# Altium project D_FEE PID.PrjPcb
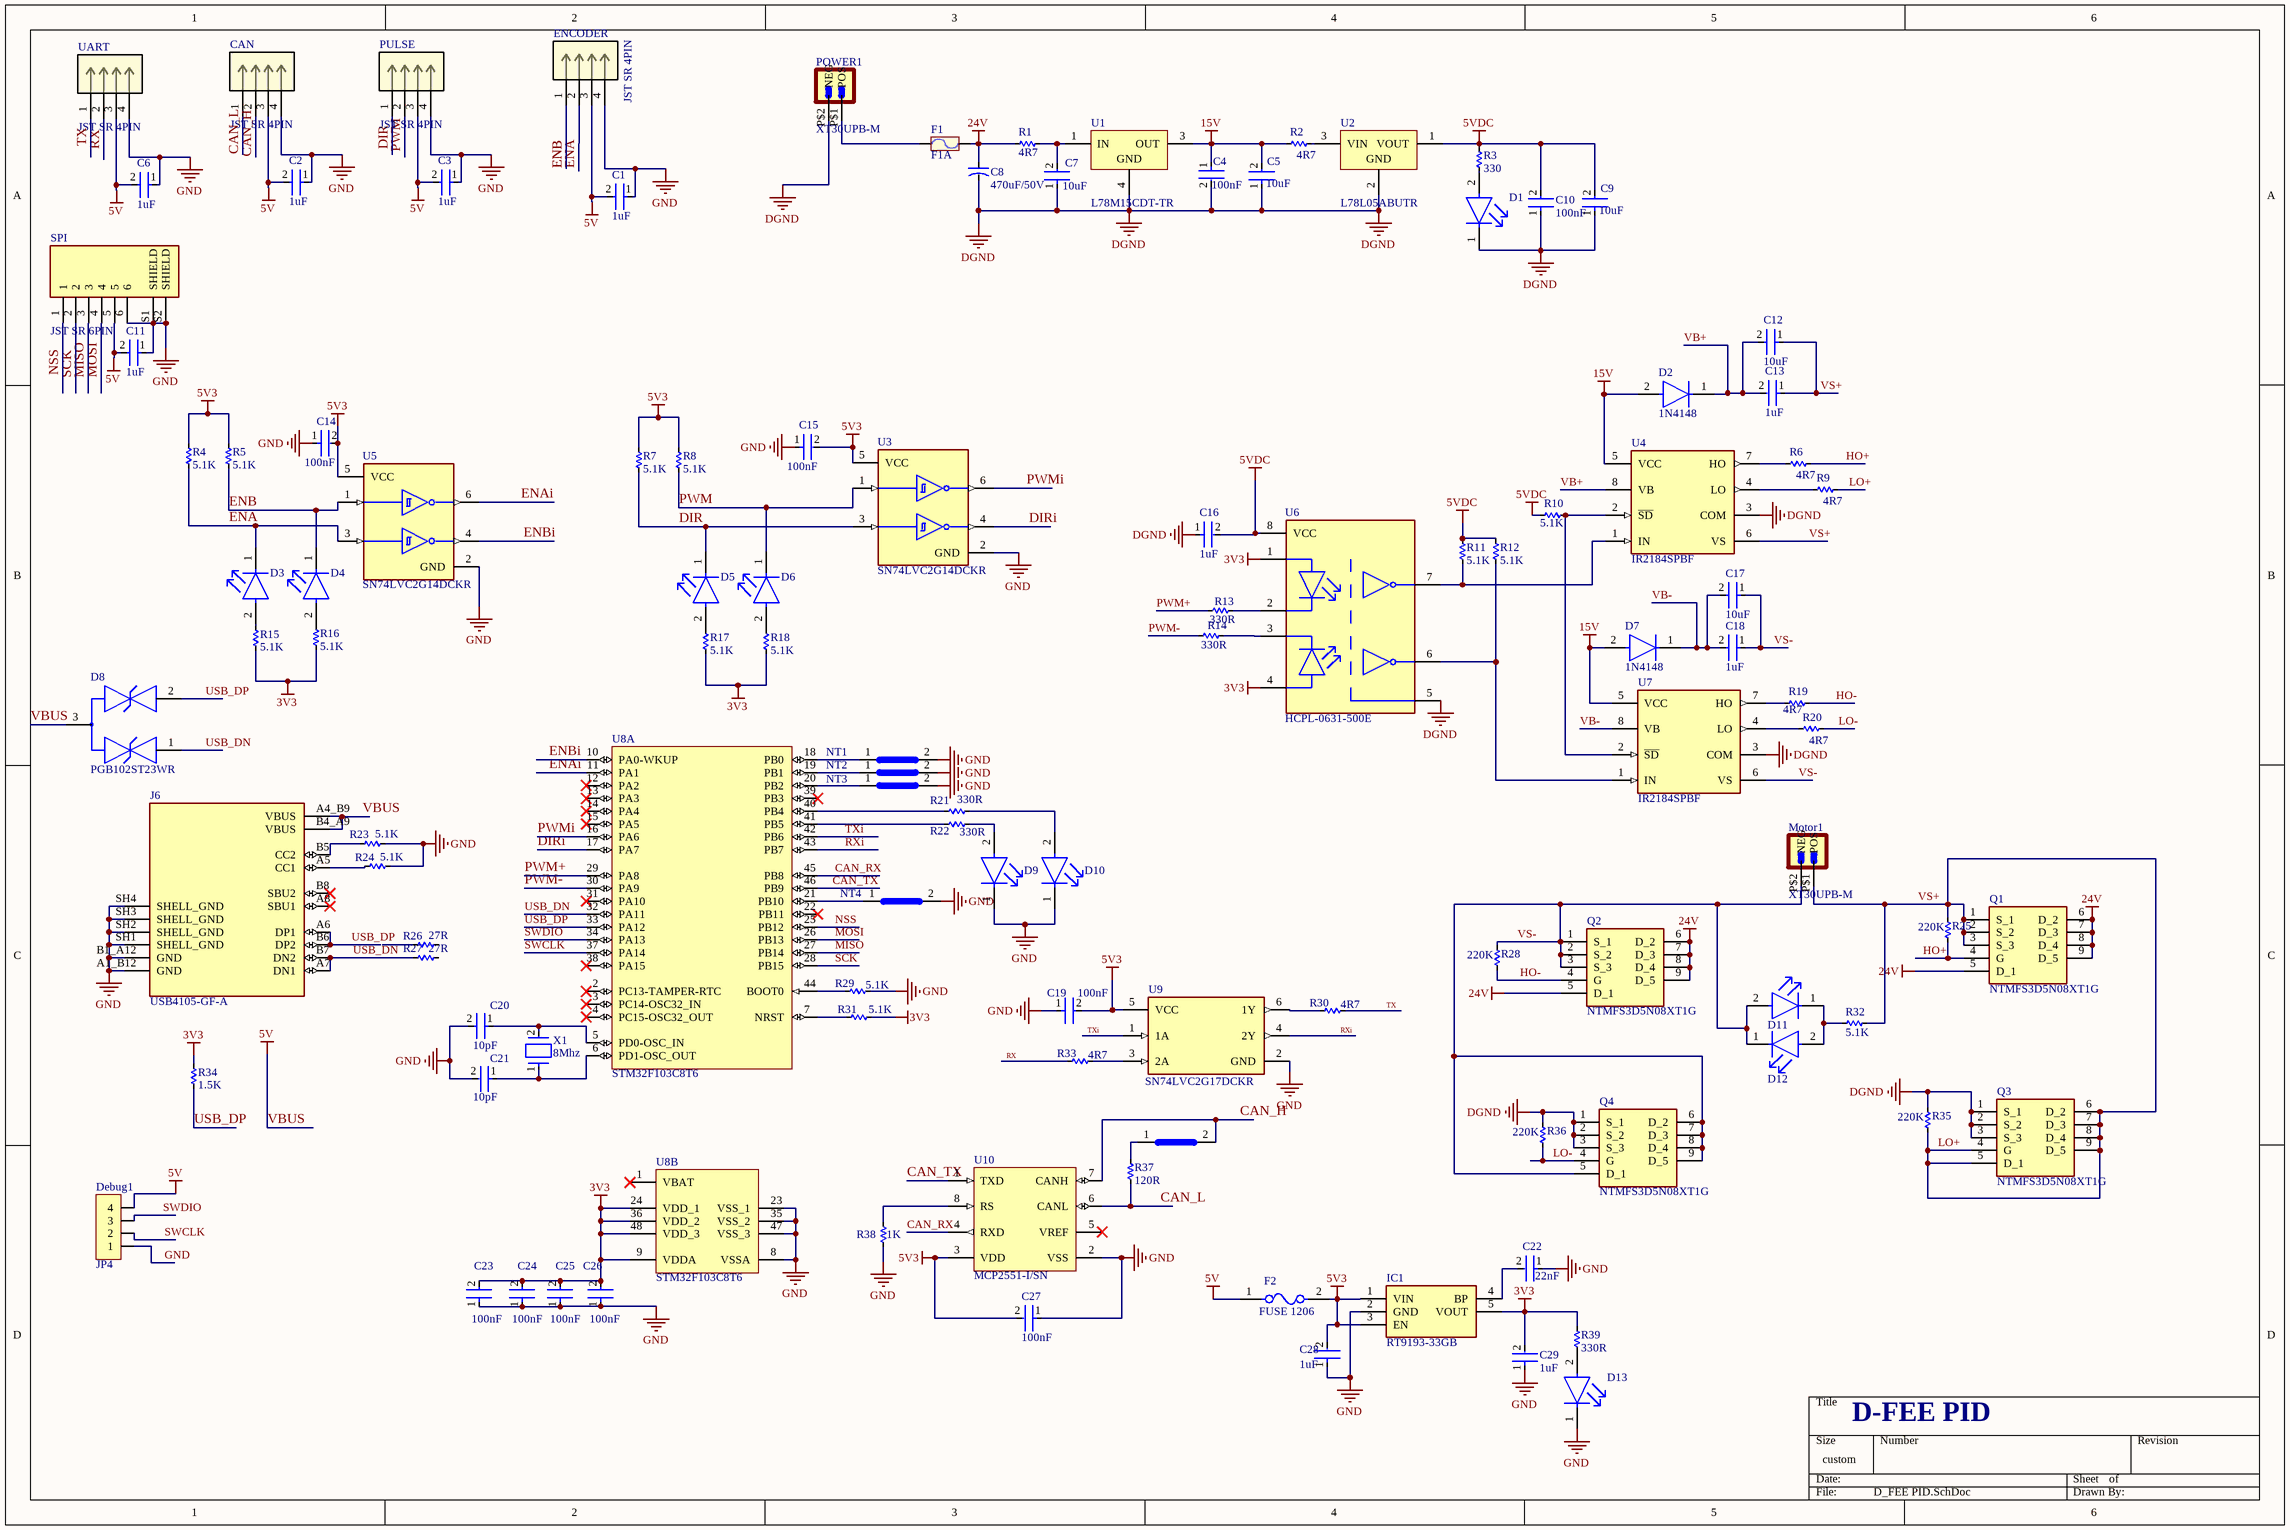
[diagram p0: D_FEE PID.SchDoc]
1 sheet, 113 parts. Net scope: global (net labels, ports and power ports of the same name join across sheets).
Board file: D_FEE PID.PcbDoc

## Sheet D_FEE PID.SchDoc
size 449 x 299 mm; SheetNumber: 1; SheetTotal: 1

### Parts
1  Node_B  [Node_B]  (value not drawn)
C1  1uF  [FP-CC0603-DA-MFG]
C2  1uF  [FP-CC0603-DA-MFG]
C3  1uF  [FP-CC0603-DA-MFG]
C4  100nF  [FP-CC0603-DA-MFG]
C5  10uF  [FP-CC0603-DA-MFG]
C6  1uF  [FP-CC0603-DA-MFG]
C7  10uF  [FP-CC0603-DA-MFG]
C8  470uF/50V  [CA-ALU-5L]
C9  10uF  [FP-CC0603-DA-MFG]
C10  100nF  [FP-CC0603-DA-MFG]
C11  1uF  [FP-CC0603-DA-MFG]
C12  10uF  [FP-CC0603-DA-MFG]
C13  1uF  [FP-CC0603-DA-MFG]
C14  100nF  [FP-CC0603-DA-MFG]
C15  100nF  [FP-CC0603-DA-MFG]
C16  1uF  [FP-CC0603-DA-MFG]
C17  10uF  [FP-CC0603-DA-MFG]
C18  1uF  [FP-CC0603-DA-MFG]
C19  100nF  [FP-CL10-0_1-MFG]
C20  10pF  [FP-CC0603-DA-MFG]
C21  10pF  [FP-CC0603-DA-MFG]
C22  22nF  [FP-CC0603-DA-MFG]
C23  100nF  [FP-CC0603-DA-MFG]
C24  100nF  [FP-CC0603-DA-MFG]
C25  100nF  [FP-CC0603-DA-MFG]
C26  100nF  [FP-CC0603-DA-MFG]
C27  100nF  [FP-CC0603-DA-MFG]
C28  1uF  [FP-CC0603-DA-MFG]
C29  1uF  [FP-CC0603-DA-MFG]
CAN  JST SR 4PIN  [JST SR 4PIN]
D1  LTST-C191KRKT  [FP-LTST-C191KRKT-MFG]  (value not drawn)
D2  1N4148  [FP-DO-213AA-MFG]
D3  LTST-C191TBKT  [FP-LTST-C191TBKT-MFG]  (value not drawn)
D4  LTST-C191TBKT  [FP-LTST-C191TBKT-MFG]  (value not drawn)
D5  LTST-C191TBKT  [FP-LTST-C191TBKT-MFG]  (value not drawn)
D6  LTST-C191TBKT  [FP-LTST-C191TBKT-MFG]  (value not drawn)
D7  1N4148  [FP-DO-213AA-MFG]
D8  PGB102ST23WR  [FP-PGB1-ST23-MFG]
D9  LTST-C191TBKT  [FP-LTST-C191TBKT-MFG]  (value not drawn)
D10  LTST-C191TBKT  [FP-LTST-C191TBKT-MFG]  (value not drawn)
D11  LTST-C191TBKT  [FP-LTST-C191TBKT-MFG]  (value not drawn)
D12  LTST-C191TBKT  [FP-LTST-C191TBKT-MFG]  (value not drawn)
D13  LTST-C191KRKT  [FP-LTST-C191KRKT-MFG]  (value not drawn)
Debug1  JP4  [JP4-C1T]
ENCODER  JST SR 4PIN  [JST SR 4PIN]
F1  F1A  [Fuse1]
F2  FUSE 1206  [FP-MF-NSMF110-2-MFG]
IC1  RT9193-33GB  [SOT94P279X130-5N]
J6  USB4105-GF-A  [GCT_USB4105-GF-A]
Motor1  XT30UPB-M  [XT30UPB-M]
NT1  Node_B  [Node_B]  (value not drawn)
NT2  Node_B  [Node_B]  (value not drawn)
NT3  Node_B  [Node_B]  (value not drawn)
NT4  Node_B  [Node_B]  (value not drawn)
POWER1  XT30UPB-M  [XT30UPB-M]
PULSE  JST SR 4PIN  [JST SR 4PIN]
Q1  NTMFS3D5N08XT1G  [NTMFS5C460NLT1G]
Q2  NTMFS3D5N08XT1G  [NTMFS5C460NLT1G]
Q3  NTMFS3D5N08XT1G  [NTMFS5C460NLT1G]
Q4  NTMFS3D5N08XT1G  [NTMFS5C460NLT1G]
R1  4R7  [RES-SMD-2010]
R2  4R7  [RES-SMD-2010]
R3  330  [RES-SMD-0603]
R4  5.1K  [RES-SMD-0603]
R5  5.1K  [RES-SMD-0603]
R6  4R7  [RES-SMD-0603]
R7  5.1K  [RES-SMD-0603]
R8  5.1K  [RES-SMD-0603]
R9  4R7  [RES-SMD-0603]
R10  5.1K  [RES-SMD-0603]
R11  5.1K  [RES-SMD-0603]
R12  5.1K  [RES-SMD-0603]
R13  330R  [RES-SMD-0603]
R14  330R  [RES-SMD-0603]
R15  5.1K  [RES-SMD-0603]
R16  5.1K  [RES-SMD-0603]
R17  5.1K  [RES-SMD-0603]
R18  5.1K  [RES-SMD-0603]
R19  4R7  [RES-SMD-0603]
R20  4R7  [RES-SMD-0603]
R21  330R  [RES-SMD-0603]
R22  330R  [RES-SMD-0603]
R23  5.1K  [RES-SMD-0603]
R24  5.1K  [RES-SMD-0603]
R25  220K  [RES-SMD-0603]
R26  27R  [RES-SMD-0603]
R27  27R  [RES-SMD-0603]
R28  220K  [RES-SMD-0603]
R29  5.1K  [RES-SMD-0603]
R30  4R7  [RES-SMD-0603]
R31  5.1K  [RES-SMD-0603]
R32  5.1K  [RES-SMD-0603]
R33  4R7  [RES-SMD-0603]
R34  1.5K  [RES-SMD-0603]
R35  220K  [RES-SMD-0603]
R36  220K  [RES-SMD-0603]
R37  120R  [RES-SMD-0603]
R38  1K  [RES-SMD-0603]
R39  330R  [RES-SMD-0603]
SPI  JST SR 6PIN  [JST SR 6PIN]
U1  L78M15CDT-TR  [TO-252_N]
U2  L78L05ABUTR  [SOT-89_L]
U3  SN74LVC2G14DCKR  [FP-DCK0006A-MFG]
U4  IR2184SPBF  [FP-PG-DSO-8-MFG]
U5  SN74LVC2G14DCKR  [FP-DCK0006A-MFG]
U6  HCPL-0631-500E  [FP-HCPL-0631-500E-IPC_C]
U7  IR2184SPBF  [FP-PG-DSO-8-MFG]
U8  STM32F103C8T6  [STM-LQFP48_L]  (parts A,B of 2)
U9  SN74LVC2G17DCKR  [FP-DCK0006A-MFG]
U10  MCP2551-I/SN  [MCHP-SN8_V]
UART  JST SR 4PIN  [JST SR 4PIN]
X1  8Mhz  [FP-ABM7-MFG]

### Nets
3V3: C23.2 C24.2 C25.2 C26.2 C29.2 IC1.5(VOUT) R15.2 R16.2 R17.2 R18.2 R31.1 R34.1 R39.1 U6.1(ANODE_1) U6.4(ANODE_2) U8.9(VDDA) U8.24(VDD_1) U8.36(VDD_2) U8.48(VDD_3)
5V3: C14.2 C15.2 C19.2 C27.2 C28.2 F2.2 IC1.1(VIN) IC1.3(EN) R4.1 R5.1 R7.1 R8.1 U3.5(VCC) U5.5(VCC) U9.5(VCC) U10.3(VDD)
5VDC: C9.2 C10.2 C16.2 R3.1 R10.1 R11.1 R12.1 U2.1(VOUT) U6.8(VCC)
15V: C4.1 C5.2 D2.2(A) D7.2(A) R2.2 U1.3(OUT) U4.5(VCC) U7.5(VCC)
24V: C8.1 F1.2 Q1.5(D_1) Q1.6(D_2) Q1.7(D_3) Q1.8(D_4) Q1.9(D_5) Q2.5(D_1) Q2.6(D_2) Q2.7(D_3) Q2.8(D_4) Q2.9(D_5) R1.2
DGND: C4.2 C5.1 C7.1 C8.2 C9.1 C10.1 C16.1 D1.1(C) POWER1.P$2(NEG) Q3.1(S_1) Q3.2(S_2) Q3.3(S_3) Q4.1(S_1) Q4.2(S_2) Q4.3(S_3) R35.1 R36.1 U1.4(GND) U2.2(GND) U4.3(COM) U6.5(GND) U7.3(COM)
GND: C1.1 C2.1 C3.1 C6.1 C11.1 C14.1 C15.1 C19.1 C20.2 C21.2 C22.1 C23.1 C24.1 C25.1 C26.1 C27.1 C28.1 C29.1 CAN.4 D9.1(C) D10.1(C) D13.1(C) Debug1.1 ENCODER.4 IC1.2(GND) J6.A1_B12(GND) J6.B1_A12(GND) J6.SH1(SHELL_GND) J6.SH2(SHELL_GND) J6.SH3(SHELL_GND) J6.SH4(SHELL_GND) NT1.2 NT2.2 NT3.2 NT4.2 PULSE.4 R23.1 R24.1 R29.1 R38.2 SPI.6 SPI.S1(SHIELD) SPI.S2(SHIELD) U3.2(GND) U5.2(GND) U8.8(VSSA) U8.23(VSS_1) U8.35(VSS_2) U8.47(VSS_3) U9.2(GND) U10.2(VSS) UART.4
VBUS: C1.2 C2.2 C3.2 C6.2 C11.2 CAN.3 D8.3 Debug1.4 ENCODER.3 F2.1 J6.A4_B9(VBUS) J6.B4_A9(VBUS) PULSE.3 SPI.5 UART.3  [also labelled 5V]
CAN_H: 1.2 CAN.2 U10.7(CANH)
CAN_L: CAN.1 R37.2 U10.6(CANL)
CAN_RX: U8.45(PB8) U10.4(RXD)
CAN_TX: U8.46(PB9) U10.1(TXD)
DIR: D5.1(C) PULSE.1 R7.2 U3.3(2A)
DIRi: U3.4(2Y) U8.17(PA7)
ENA: D3.1(C) ENCODER.2 R4.2 U5.3(2A)
ENAi: U5.6(1Y) U8.11(PA1)
ENB: D4.1(C) ENCODER.1 R5.2 U5.1(1A)
ENBi: U5.4(2Y) U8.10(PA0-WKUP)
HO+: Q1.4(G) R6.1 R25.2
HO-: Q2.4(G) R19.1 R28.2
LO+: C12.1 C13.1 Motor1.P$1(POS) Q1.1(S_1) Q1.2(S_2) Q1.3(S_3) Q3.4(G) Q3.5(D_1) Q3.6(D_2) Q3.7(D_3) Q3.8(D_4) Q3.9(D_5) R9.1 R25.1 R32.2 R35.2 U4.6(VS)  [also labelled VS+]
LO-: Q4.4(G) R20.1 R36.2
MISO: SPI.3 U8.27(PB14)
MOSI: SPI.4 U8.26(PB13)
NSS: SPI.1 U8.25(PB12)
PWM: D6.1(C) PULSE.2 R8.2 U3.1(1A)
PWM+: R13.2 U8.29(PA8)
PWM-: R14.2 U8.30(PA9)
PWMi: U3.6(1Y) U8.16(PA6)
RX: R33.2 UART.2
RXi: U8.43(PB7) U9.4(2Y)
SCK: SPI.2 U8.28(PB15)
SWCLK: Debug1.2 U8.37(PA14)
SWDIO: Debug1.3 U8.34(PA13)
TX: R30.1 UART.1
TXi: U8.42(PB6) U9.1(1A)
USB_DN: D8.1 J6.A7(DN1) J6.B7(DN2) R27.2 U8.32(PA11)
USB_DP: D8.2 J6.A6(DP1) J6.B6(DP2) R34.2 U8.33(PA12)
VB+: C12.2 C13.2 D2.1(C) U4.8(VB)
VB-: C17.2 C18.2 D7.1(C) U7.8(VB)
VS-: C17.1 C18.1 D11.2(A) D12.1(C) Motor1.P$2(NEG) Q2.1(S_1) Q2.2(S_2) Q2.3(S_3) Q4.5(D_1) Q4.6(D_2) Q4.7(D_3) Q4.8(D_4) Q4.9(D_5) R28.1 U7.6(VS)
Net1_1: 1.1(Node?) R37.1
NetC7_2: C7.2 R1.1 U1.1(IN)
NetC20_1: C20.1 U8.5(PD0-OSC_IN) X1.2
NetC21_1: C21.1 U8.6(PD1-OSC_OUT) X1.1
NetC22_2: C22.2 IC1.4(BP)
NetD1_2: D1.2(A) R3.2
NetD3_2: D3.2(A) R15.1
NetD4_2: D4.2(A) R16.1
NetD5_2: D5.2(A) R17.1
NetD6_2: D6.2(A) R18.1
NetD9_2: D9.2(A) R22.2
NetD10_2: D10.2(A) R21.2
NetD11_1: D11.1(C) D12.2(A) R32.1
NetD13_2: D13.2(A) R39.2
NetF1_1: F1.1 POWER1.P$1(POS)
NetJ6_A5: J6.A5(CC1) R24.2
NetJ6_B5: J6.B5(CC2) R23.2
NetNT1_1: NT1.1(Node?) U8.18(PB0)
NetNT2_1: NT2.1(Node?) U8.19(PB1)
NetNT3_1: NT3.1(Node?) U8.20(PB2)
NetNT4_1: NT4.1(Node?) U8.21(PB10)
NetR2_1: R2.1 U2.3(VIN)
NetR6_2: R6.2 U4.7(HO)
NetR9_2: R9.2 U4.4(LO)
NetR10_2: R10.2 U4.2(~{SD}) U7.2(~{SD})
NetR11_2: R11.2 U4.1(IN) U6.7(VO1)
NetR12_2: R12.2 U6.6(VO2) U7.1(IN)
NetR13_1: R13.1 U6.2(CATHODE_1)
NetR14_1: R14.1 U6.3(CATHODE_2)
NetR19_2: R19.2 U7.7(HO)
NetR20_2: R20.2 U7.4(LO)
NetR21_1: R21.1 U8.40(PB4)
NetR22_1: R22.1 U8.41(PB5)
NetR29_2: R29.2 U8.44(BOOT0)
NetR30_2: R30.2 U9.6(1Y)
NetR31_2: R31.2 U8.7(NRST)
NetR33_1: R33.1 U9.3(2A)
NetR38_1: R38.1 U10.8(RS)

Not connected (* = marked no-connect by the designer): J6 A8(SBU1)* B8(SBU2)*; R26 1 2; R27 1; U8 1(VBAT)* 2(PC13-TAMPER-RTC)* 3(PC14-OSC32_IN)* 4(PC15-OSC32_OUT)* 12(PA2)* 13(PA3)* 14(PA4)* 15(PA5)* 22(PB11)* 31(PA10)* 38(PA15)* 39(PB3)*; U10 5(VREF)*

### Notes on the sheet
- D-FEE PID

### Library data of the parts
1 NT1-NT4 = Node_B: Node
C1-C7 C9-C18 C20-C29 = CMP-2100-03600-2: CAP CER 10000PF 50V X7R 0603; Manufacturer Part Number: CC0603KRX7R9BB103; Manufacturer: YAGEO; Tolerance: 0.1; Material: Ceramic; Temperature Coefficient: 15%; Value: 10 nF; Mouser Description: Multilayer Ceramic Capacitor, CC Series, 0.01 - F, - 10%, X7R, 50 V, 0603 [1608 Metric]; Digikey Description: CAP CER 10000PF 50V X7R 0603; Height: 0.9mm; Category: Cap; Temperature Characteristic: X7R; Footprint Url: http://www.yageo.com/exep/pages/download/literatures/UPY-C_GEN_24.pdf; Lead Free: Yes; Voltage Rating: 50 V; Temperature: -55°C to +125°C; Device Class L3: Ceramic Capacitors; ComponentLink2Description: Datasheet; Voltage: 50 V; Package: CC0603-DA; Octopart: https://octopart.com/cc0603krx7r9bb103-yageo-192938; Automotive: No; Temperature Range High: +125°C; Temperature Range Low: -55°C; RoHS: TRUE; Device Class L1: Passive Components; ComponentLink2URL: http://www.yageo.com/documents/recent/UPY-GPHC_X7R_6.3V-to-50V_18.pdf; Device Class L2: Capacitors; Capacitance: 10 nF
C8 = CN-ALU-DIP: Capacitor (Semiconductor SIM Model); Value: 104; LatestRevisionDate: 17-Jul-2002; LatestRevisionNote: Re-released for DXP Platform.; PackageReference: C1206; Publisher: Altium Limited
C19 = CMP-13271-000011-1: CAP CER 0.1UF 50V X7R 0603; Manufacturer: Samsung Electro-Mechanics America, Inc; Manufacturer Part Number: CL10B104JB8NNNC; Material: Ceramic; Temperature Coefficient: 15%; Tolerance: 5%; Ipc Land Pattern Name: CAPC16080X80; Device Class L1: Passive Components; Digikey Description: CAP CER 0.1UF 50V X7R 0603; Voltage Rating: 50V; Height: 0.9mm; ComponentLink2Description: Datasheet; Device Class L2: Capacitors; ComponentLink2URL: http://www.samsungsem.com/kr/support/product-search/mlcc/__icsFiles/afieldfile/2019/06/18/CL10B104JB8NNNC-19.pdf; Temperature Characteristic: X7R; Value: 100nF; Temperature Range High: +125°C; Lead Free: Yes; Temperature Range Low: -55°C; Category: Cap; Package: CL10-0.1; Temperature: -55°C to +125°C; Octopart: https://octopart.com/cl10b104jb8nnnc-samsung-9302151; Device Class L3: Ceramic Capacitors; RoHS: TRUE; Automotive: No; Capacitance: 100nF
CAN ENCODER PULSE UART = JST SR 4PIN: SM04B-SRSS-TB; Mfr_Name: JST; RefDes: RefDes; Type: Type
D1 D13 = CMP-2000-05199-2: NexarPartId: 549908; Illumination Color: Red; Lens Transparency: Clear; Luminous Intensity: 54mcd; Current: 2A; Forward Current: 20mA; Number of Elements: 1; Power Rating: 75mW; Lens Color: Colorless; Wavelength: 639nm; Viewing Angle: 130°; Voltage: 2V; Dominant Wavelength: 631nm; Reverse Voltage: 5V; Height: 550µm; Length: 1.6mm; Number of Pins: 2; Packaging: Tape and Reel; Mount: Surface Mount; Case Code (Metric): 1608; Radiation Hardening: No; Case Code (Imperial): 0603; Test Current: 20mA; Number of LEDs: 1; Schedule B: 8541402000, 8541402000; Lead Free: Lead Free; Power Dissipation: 75mW; RoHS: Compliant; Forward Voltage: 2V; Lens Style: Clear; Color: Red; Max Operating Temperature: 85°C; Depth: 800µm; Width: 800µm; Min Operating Temperature: -55°C; Case/Package: 0603
D2 D7 = CMP-06359-000012-1: DIODE GEN PURP 75V 200MA DO213AA
D3-D6 D9-D12 = CMP-22017-000008-1: LED BLUE CLEAR CHIP SMD; Lens Color: Colorless; Dominant Wavelength: 475nm; Forward Current: 20mA; Wavelength: 468nm; Viewing Angle: 130°; Power Dissipation: 76mW; Luminous Intensity: 180mcd; Reverse Voltage: 5V; Number of Elements: 1; Lens Style: Diffused; Forward Voltage: 3.8V; Max Power Dissipation: 75mW; Case Code (Metric): 1608; Packaging: Tape and Reel; Case/Package: 0603; Depth: 1.6mm; Mount: Surface Mount; Lead Free: Lead Free; Min Operating Temperature: -20°C; Lens Transparency: Clear; Illumination Color: Blue; Height: 0.55mm; Test Current: 20mA; Case Code (Imperial): 0603; Max Operating Temperature: 80°C; Number of Pins: 2; Length: 0.8mm; Radiation Hardening: No; Package Quantity: 1; Number of LEDs: 1; Width: 0.8mm; Color: Blue
D8 = CMP-08607-000007-1: TVS DIODE 24V 150V SOT23-3; Manufacturer: Littelfuse Inc; Direction: Bidirectional; Value: 0.12pF; Number Of Channels: 2; Lead Free: Yes; Height: 0.79mm; Package: PGB1-ST23; Device Class L1: Circuit Protection; Clamping Voltage: 150V; Temperature Range High: +125°C; Temperature: -65°C to +125°C; Digikey Description: TVS DIODE 24V 150V SOT23-3; Automotive: No; Manufacturer Part Number: PGB102ST23WR; ComponentLink2URL: https://www.littelfuse.com/~/media/electronics/datasheets/pulseguard_esd_suppressors/littelfuse_pulseguard_pgb1_datasheet.pdf.pdf; Mouser Description: ESD Suppressors PulseGuard ESD SOT23 24VDC PGB102ST23WR; ComponentLink2Description: Datasheet; Device Class L2: TVS Diodes; Octopart: https://octopart.com/pgb102st23wr-littelfuse-347719; RoHS: TRUE; Category: Diode; Capacitance: 0.12pF; Temperature Range Low: -65°C; Device Class L3: unset
Debug1 = JP4: WR-PHD 2.54 mm Angled Socket Header; Manufacturer: W¨¹rth Elektronik eiSos GmbH; partNo: 613004143121; ComponentLink1 Description: Manufacturer; ComponentLink2 Description: Datasheet; NoPins: 04; Created Date: 29 March 2013; ComponentLink1URL: http://www.we-online.com; ComponentLink2URL: http://katalog.we-online.de/em/datasheet/6130xx143121.pdf; Created by: Karrer Zheng
F1 = Fuse: Designed by: VanDungEvn; Value: Fuse
F2 = CMP-07400-000012-1: PTC RESET FUSE 6V 1.1A 1206; Manufacturer: Bourns; Manufacturer Part Number: MF-NSMF110-2; Trip Current: 2.2A; Current Rating: 100A; Trip Time: 0.1s; Resistance: 0.06-0.2Ω; Value: 0.06-0.2Ω; Automotive Grade: Grade 3; Category: Fuse; Digikey Description: PTC RESET FUSE 6V 1.1A 1206; RoHS: TRUE; Temperature: -40°C to +85°C; Lead Free: Yes; Temperature Range High: +85°C; Ambient Temperature Range Low: -40°C; Mouser Description: Resettable Fuses - PPTC 1.1A 6V 0.06ohm; Hold Current: 1.1A; ComponentLink2URL: https://www.bourns.com/docs/Product-Datasheets/mfnsmf.pdf; Height: 0.7mm; Device Class L2: PTC Resettable Fuses; ComponentLink2Description: Datasheet; Automotive: Yes; Ambient Temperature Range High: +85°C; Temperature Range Low: -40°C; Device Class L1: Circuit Protection; Octopart: https://octopart.com/mf-nsmf110-2-bourns-41795; Voltage Rating: 6V; Package: MF-NSMF110-2; Device Class L3: unset
IC1 = RT9193-33GB: Integrated Circuit; Manufacturer_Name: RICHTEK; Datasheet Link: http://www.richtek.com/assets/product_file/RT9193/DS9193-17.pdf; Height: 1.295mm; Manufacturer_Part_Number: RT9193-33GB; Mouser Part Number: 835-RT9193-33GB; Mouser Price/Stock: https://www.mouser.co.uk/ProductDetail/Richtek/RT9193-33GB?qs=amGC7iS6iy8ybRcZ9Wn2ww%3D%3D
J6 = USB4105-GF-A: MF: {'manufacturer': u'GCT'}; Package: None; Price: None; Value: *; MP: USB4105-GF-A; Availability: Unavailable
Motor1 POWER1 = XT30UPB-M: Socket; DC supply; XT30; male; PIN: 2; on PCBs; THT; yellow; 15A; 500V; MF: amass; MP: XT30UPB-M; Value: *; SnapEDA_Link: https://www.snapeda.com/parts/XT30UPB-M/AMASS/view-part/?ref=snap; Price: None; Package: None; Check_prices: https://www.snapeda.com/parts/XT30UPB-M/AMASS/view-part/?ref=eda; Availability: Not in stock
Q1-Q4 = NTMFS3D5N08XT1G: MOSFET (N-Channel); Manufacturer_Name: onsemi; Datasheet Link: https://www.onsemi.com/download/data-sheet/pdf/ntmfs3d5n08x-d.pdf; Height: 1.1mm; Manufacturer_Part_Number: NTMFS3D5N08XT1G
R1-R39 = Res-SMD: Resistor; Manufacturer: Generic Components; Class: Passive; Published: 08/06/2000; Publisher: Altium Hobart Technology Centre
SPI = JST SR 6PIN: Connector Header Surface Mount, Right Angle 6 position 0.039 _1.00mm_SM06B-SRSS-TB(LF)(SN); MP: SM06B-SRSS-TB_LF__SN_; MF: JST Sales; Package: None; Value: *; SnapEDA_Link: https://www.snapeda.com/parts/SM06B-SRSS-TB%28LF%29%28SN%29/JST%20Sales%20America%20Inc./view-part/554386/?ref=snap; Digi-Key_Purchase_URL: https://www.digikey.com/product-detail/en/jst-sales-america-inc/SM06B-SRSS-TB_LF__SN_/455-1806-1-ND/926877?utm_source=snapeda&utm_medium=aggregator&utm_campaign=symbol; Digi-Key_Part_Number: 455-1806-1-ND
U1 = CMP-0244-00203-1: Positive Voltage Regulator, 15V, 3-Pin DPAK, Tape and Reel; ComponentLink1Description: Manufacturer URL; ComponentLink1URL: http://www.st.com; PackageDescription: 3-Pin Transistor Outline Package 2.28 mm Pitch, 9.7 mm Lead Span (DPAK); PackageReference: TO-252; DatasheetVersion: 1/11/2010; ComponentLink2Description: Datasheet; ComponentLink2URL: http://www.st.com/internet/com/TECHNICAL_RESOURCES/TECHNICAL_LITERATURE/DATASHEET/CD00000447.pdf; PackageVersion: 2011
U2 = CMP-0244-00406-1: Positive Voltage Regulator, 5V, 4-Pin SOT-89, Tape and Reel; PackageVersion: 2011; DatasheetVersion: 1/02/2011; PackageDescription: 3-Pin SOT-89 Package 1.5 mm Pitch, 4.1 mm Lead Span; PackageReference: SOT-89; ComponentLink2Description: Datasheet; ComponentLink1URL: http://www.st.com; ComponentLink1Description: Manufacturer URL; ComponentLink2URL: http://www.st.com/internet/com/TECHNICAL_RESOURCES/TECHNICAL_LITERATURE/DATASHEET/CD00000446.pdf
U3 U5 = CMP-0859-00454-5: IC INVERTER SCHMITT 2CH SC70-6; Logic Function: Inverting; Max Supply Voltage: 5.5V; Propagation Delay: 9.5ns; Number of Elements: 2; Max Output Current: 32mA; High Level Output Current: -32mA; Min Supply Voltage: 1.65V; Number of Inputs: 1; Quiescent Current: 10uA; Radiation Hardening: No; Max Operating Temperature: 125°C; Packaging: Tape and Reel; Termination: SMD/SMT; Lead Free: Lead Free; RoHS Compliant: Yes; Contact Plating: Gold; Number of Bits: 2; Turn-On Delay Time: 9.5ns; Output Current: 32mA; Number of Circuits: 2; Mount: Surface Mount; Case/Package: SC; Low Level Output Current: 32mA; REACH SVHC: No SVHC; Number of Pins: 6; Package Quantity: 3000; Min Operating Temperature: -40°C; Number of Gates: 2; Weight: 8.8E-05oz
U4 U7 = CMP-32851-000025-1: IC GATE DRVR HALF-BRIDGE 8SOIC; Manufacturer: Infineon; Min Supply Voltage: 10V; Number Of Outputs: 1; Turn On Delay Time: 680ns; Max Supply Voltage: 20V; Number Of Drivers: 2; Max Junction Temp: +150°C; Nominal Supply Current: 60-1000uA; Turn Off Delay Time: 270ns; Standoff Height: 0.1mm; Max Power Dissipation: 0.625W; Rise Time: 40ns; Fall Time: 20ns; Temperature: to +150°C; Height: 1.75mm; Ambient Temperature Range High: +125°C; Manufacturer Part Number: IR2184SPBF; ComponentLink2URL: https://www.infineon.com/dgdl/ir2184.pdf?fileId=5546d462533600a4015355c955e616d4; ComponentLink2Description: Datasheet; RoHS: TRUE; Octopart: https://octopart.com/ir2184spbf-infineon-65872954; Ipc Land Pattern Name: SOIC127P600X155-8; Package: PG-DSO-8; Footprint Url: https://www.infineon.com/dgdl/Infineon-po-8leadsoic-P-v01_00-EN.pdf?fileId=5546d462580663ef0158068b4ad80177; Category: IC; Digikey Description: IC GATE DRVR HALF-BRIDGE 8SOIC; Automotive: No; Device Class L3: Gate Drivers; Device Class L2: Power Management ICs; Temperature Range High: +150°C; Lead Free: Yes; Ambient Temperature Range Low: -40°C; Device Class L1: Integrated Circuits (ICs)
U6 = CMP-18400-000027-1: OPTOISO 3.75KV 2CH OPEN COLL 8SO; Reverse Breakdown Voltage: 5V; Propagation Delay: 75ns; Max Power Dissipation: 60mW; Output Voltage: 7V; Forward Current: 15mA; Data Rate: 10Mbps; Output Current: 50mA; Input Type: DC; Rise Time: 24ns; Direction: Unidirectional; Fall Time: 10ns; Number of Elements: 2; Forward Voltage: 1.5V; Package Quantity: 1; Number of Pins: 8; Series: -; REACH SVHC: No SVHC; Packaging: Tape and Reel; Case/Package: SOIC; Turn-On Delay Time: 75ns; Power Dissipation: 60mW; Lead Free: Lead Free; Output Current per Channel: 50mA; Isolation Voltage: 3.75kV; Voltage: 5V; Max Collector Current: 50mA; RoHS Compliant: Yes; Max Output Voltage: 7V; Input Current: 15mA; Max Operating Temperature: 85°C; Contact Plating: Tin; Reverse Voltage (DC): 5V; Min Operating Temperature: -40°C; Radiation Hardening: No; Isolation Voltage-Max: 3.75kV; Number of Channels: 2; Mount: Surface Mount
U8 = CMP-0237-00215-3: ARM Cortex-M3 32-bit MCU, 64 KB Flash, 20 KB Internal RAM, 37 I/Os, 48-pin LQFP, -40 to 85 degC, Tray; Supply Voltage(Vcc) min (V): 2; Internal RAM Size (kB): 20; FLASH Size (Prog) (kB): 64; A/D Converter: 2x12-bit (10 Channel); I/Os (High Current): 37; Operating Frequency(F) (Processor speed) (MHz): 72; Core: ARM Cortex-M3; ComponentLink3Description: Package Specification; Mounting Technology: Surface Mount; PartNumber: STM32F103C8T6; PackageReference: LQFP48; Packing: Tray; ComponentLink3URL: http://www.st.com/st-web-ui/static/active/en/resource/technical/document/datasheet/DM00058181.pdf; DatasheetVersion: Rev. 16; ComponentLink1URL: http://www.st.com/web/en/home.html; PackageVersion: Rev. 6, 06/2013; ComponentLink2URL: http://www.st.com/st-web-ui/static/active/en/resource/technical/document/datasheet/CD00161566.pdf; ComponentLink1Description: Manufacturer URL; ComponentLink2Description: Datasheet; PackageDescription: 48-Pin Low Profile Quad Flat Package, 7 x 7 mm Body, 0.5 mm Pitch
U9 = CMP-0859-00517-5: IC BUF NON-INVERT 5.5V SC70-6; Schmitt Trigger Input: Yes; Number of Inputs: 2; Propagation Delay: 4.3ns; Number of Bits per Element: 1; Logic Function: Schmitt Trigger; Polarity: Non-Inverting; Low Level Output Current: 32mA; High Level Output Current: -32mA; Min Supply Voltage: 1.65V; Nominal Supply Current: 250mA; Quiescent Current: 10uA; Turn-On Delay Time: 9.3ns; Number of Pins: 6; Number of Channels: 2; Length: 2mm; Min Operating Temperature: -40°C; Contact Plating: Gold; Lead Free: Lead Free; Termination: SMD/SMT; Width: 1.25mm; Package Quantity: 1; REACH SVHC: No SVHC; Number of Bits: 2; Max Supply Voltage: 5.5V; Number of Output Lines: 2; Mount: Surface Mount; Number of Circuits: 2; Packaging: Tape and Reel; Case/Package: SC; Number of Input Lines: 2; Number of Gates: 2; RoHS Compliant: Yes; Height: 0.9mm; Max Operating Temperature: 125°C; Number of Elements: 2; Number of Outputs: 2; Radiation Hardening: No
U10 = CMP-0186-00138-3: High-Speed CAN Transceiver, / 1 Mb/s, 4.5 to 5.5 V, 8-Pin SOIC (SN), Industrial Temperature, RoHS, Tube; Manufacturer: Microchip; RoHSCompliant: true; PackageReference: SN8; ComponentLink1URL: http://www.microchip.com/; DatasheetVersion: Rev. F, 07/2010; ComponentLink2Description: Datasheet; ComponentLink2URL: http://ww1.microchip.com/downloads/en/DeviceDoc/21667f.pdf; ComponentLink3Description: Package Specification; PackageDescription: 8-Pin Small Outline Integrated Circuit, Body 4.9 x 3.9 mm, Pitch 1.27 mm; ComponentLink1Description: Manufacturer URL; Mounting Technology: Surface Mount; ComponentLink3URL: http://www.microchip.com/stellent/groups/techpub_sg/documents/packagingspec/en012702.pdf
X1 = CMP-2000-05034-2: Crystal 8MHz ±20ppm 18pF SMD-2 6mm x 3.5mm; ESR (Equivalent Series Resistance): 100R; Series Resistance: 80R; Frequency Stability: 30ppm; Resistor Type: Ceramic; Radiation Hardening: No; Height: 0.055inch; Packaging: Tape and Reel; Lead Free: Lead Free; Min Operating Temperature: -40°C; Termination: SMD/SMT; REACH SVHC: Yes; Number of Pins: 2; Mount: Surface Mount; Case/Package: CSMD; Tolerance: 20ppm; Max Operating Temperature: 85°C; Series: ABM7; Frequency Tolerance: 20ppm; Load Capacitance: 18pF; Length: 6mm; Frequency: 8MHz; Width: 0.138inch; Package Quantity: 1000; Depth: 3.5mm; Operating Frequency: 8 MHz